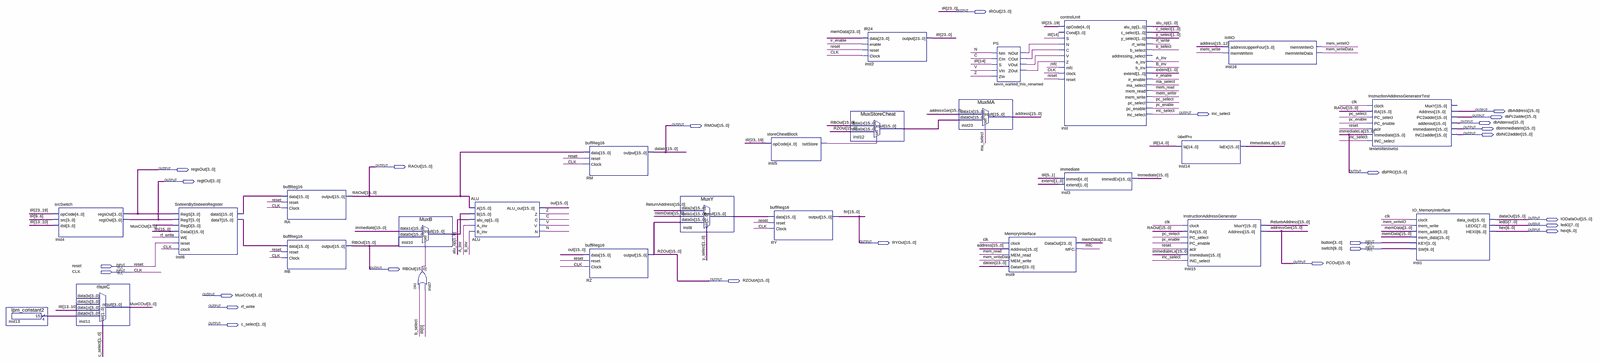
[diagram p0: schematic sheet, whole]
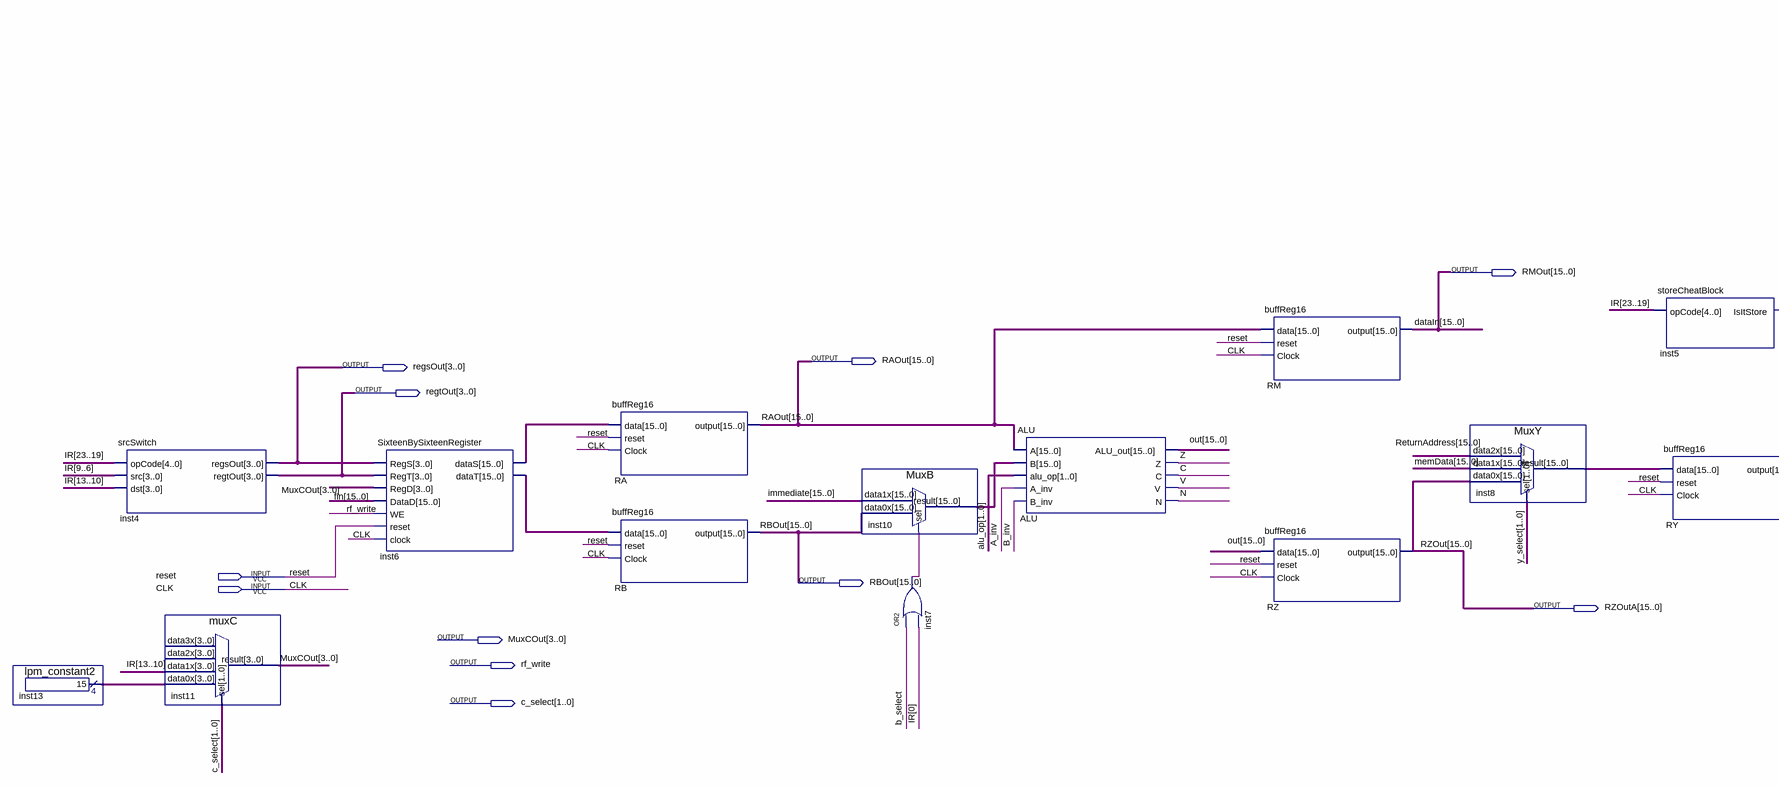
[diagram p1: schematic sheet, left part]
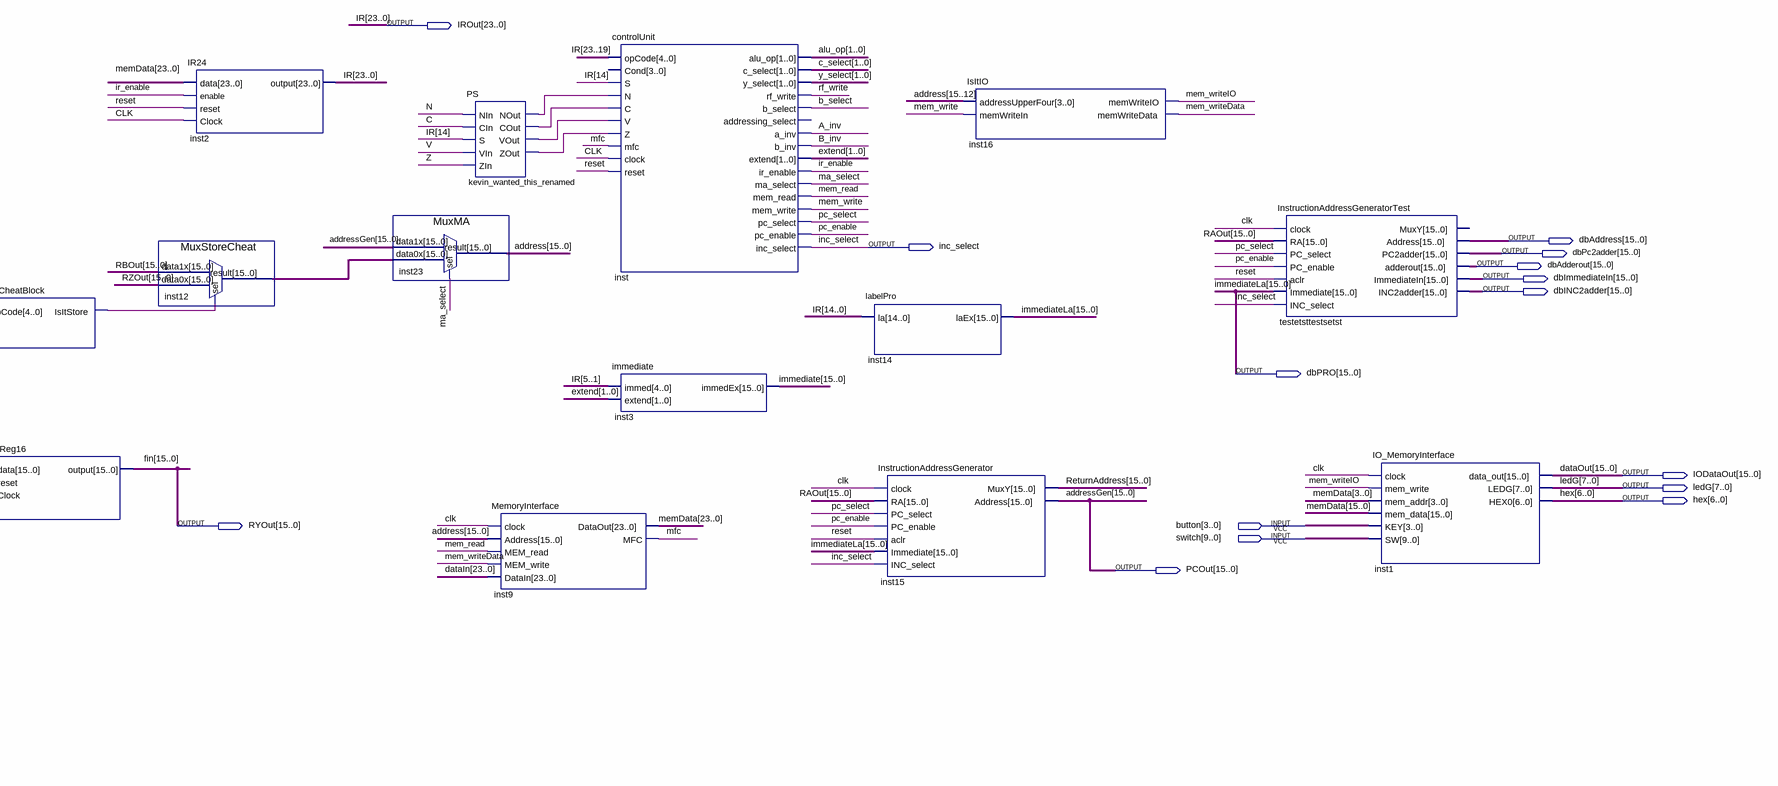
[diagram p2: schematic sheet, right part]
// Quartus schematic Processor.bdf as structural Verilog: 26 symbols, 26 pins
module Processor (
  input  [3:0] button,
  input  [9:0] switch,
  input  reset,
  input  CLK,
  output [23:0] IROut,
  output [15:0] dbAddress,
  output inc_select,
  output [15:0] dbPc2adder,
  output [15:0] dbAdderout,
  output [15:0] RMOut,
  output [15:0] dbImmediateIn,
  output [15:0] dbINC2adder,
  output [15:0] RAOut,
  output [3:0] regsOut,
  output [15:0] dbPRO,
  output [3:0] regtOut,
  output [15:0] IODataOut,
  output [7:0] ledG,
  output [6:0] hex,
  output [15:0] RYOut,
  output [15:0] PCOut,
  output [15:0] RBOut,
  output [15:0] RZOutA,
  output [3:0] MuxCOut,
  output rf_write,
  output [1:0] c_select
);

  wire A_inv, B_inv, b_select, C, inst5_isitstore, inst7_out, ir_enable, kevin_wanted_this_renamed_cout,
       kevin_wanted_this_renamed_nout, kevin_wanted_this_renamed_vout, kevin_wanted_this_renamed_zout,
       ma_select, mem_read, mem_write, mem_writeData, mem_writeIO, mfc, N, pc_enable, pc_select, V, Z;
  wire [1:0] alu_op, extend, y_select;
  wire [3:0] inst13_result;
  wire [15:0] address, immediate, inst6_datas, inst6_datat, inst8_result, inst10_result, inst12_result, out,
       ReturnAddress;
  wire [23:0] memData;
  wire [23:16] dataIn;

  lpm_constant2 inst13 (.result(inst13_result));
  srcSwitch inst4 (.opCode(IROut[23:19]), .src(IROut[9:6]), .dst(IROut[13:10]), .regsOut(regsOut), .regtOut(regtOut));
  muxC inst11 (
    .data1x(IROut[13:10]), .data0x(inst13_result), .sel(c_select), .result(MuxCOut));  // open: data3x, data2x
  SixteenBySixteenRegister inst6 (
    .RegS(regsOut), .RegT(regtOut), .RegD(MuxCOut), .DataD(RYOut), .WE(rf_write), .reset(reset), .clock(CLK),
    .dataS(inst6_datas), .dataT(inst6_datat));
  buffReg16 RA (.data(inst6_datas), .reset(reset), .Clock(CLK), .\output (RAOut));
  buffReg16 RB (.data(inst6_datat), .reset(reset), .Clock(CLK), .\output (RBOut));
  MuxB inst10 (.data1x(immediate), .data0x(RBOut), .sel(inst7_out), .result(inst10_result));
  or inst7 (inst7_out, b_select, IROut[0]);
  ALU ALU (
    .A(RAOut), .B(inst10_result), .alu_op(alu_op), .A_inv(A_inv), .B_inv(B_inv), .ALU_out(out), .Z(Z), .C(C),
    .V(V), .N(N));
  buffReg16 RM (.data(RAOut), .reset(reset), .Clock(CLK), .\output (RMOut));
  buffReg16 RZ (.data(out), .reset(reset), .Clock(CLK), .\output (RZOutA));
  MuxY inst8 (.data2x(ReturnAddress), .data1x(memData[15:0]), .data0x(RZOutA), .sel(y_select), .result(inst8_result));
  storeCheatBlock inst5 (.opCode(IROut[23:19]), .IsItStore(inst5_isitstore));
  buffReg16 RY (.data(inst8_result), .reset(reset), .Clock(CLK), .\output (RYOut));
  IR24 inst2 (.data(memData), .enable(ir_enable), .reset(reset), .Clock(CLK), .\output (IROut));
  MuxStoreCheat inst12 (.data1x(RBOut), .data0x(RZOutA), .sel(inst5_isitstore), .result(inst12_result));
  MuxMA inst23 (.data1x(PCOut), .data0x(inst12_result), .sel(ma_select), .result(address));
  PS kevin_wanted_this_renamed (
    .NIn(N), .CIn(C), .S(IROut[14]), .VIn(V), .ZIn(Z), .NOut(kevin_wanted_this_renamed_nout),
    .COut(kevin_wanted_this_renamed_cout), .VOut(kevin_wanted_this_renamed_vout),
    .ZOut(kevin_wanted_this_renamed_zout));
  MemoryInterface inst9 (
    .clock(CLK), .Address(address), .MEM_read(mem_read), .MEM_write(mem_writeData), .DataIn({dataIn, RMOut}),
    .DataOut(memData), .MFC(mfc));
  controlUnit inst (
    .opCode(IROut[23:19]), .S(IROut[14]), .N(kevin_wanted_this_renamed_nout),
    .C(kevin_wanted_this_renamed_cout), .V(kevin_wanted_this_renamed_vout),
    .Z(kevin_wanted_this_renamed_zout), .mfc(mfc), .clock(CLK), .reset(reset), .alu_op(alu_op),
    .c_select(c_select), .y_select(y_select), .rf_write(rf_write), .b_select(b_select), .a_inv(A_inv),
    .b_inv(B_inv), .extend(extend), .ir_enable(ir_enable), .ma_select(ma_select), .mem_read(mem_read),
    .mem_write(mem_write), .pc_select(pc_select), .pc_enable(pc_enable), .inc_select(inc_select));  // open: Cond, addressing_select
  immediate inst3 (.immed(IROut[5:1]), .extend(extend), .immedEx(immediate));
  labelPro inst14 (.la(IROut[14:0]), .laEx(dbPRO));
  InstructionAddressGenerator inst15 (
    .clock(CLK), .RA(RAOut), .PC_select(pc_select), .PC_enable(pc_enable), .aclr(reset), .Immediate(dbPRO),
    .INC_select(inc_select), .MuxY(ReturnAddress), .Address(PCOut));
  IsItIO inst16 (
    .addressUpperFour(address[15:12]), .memWriteIn(mem_write), .memWriteIO(mem_writeIO),
    .memWriteData(mem_writeData));
  InstructionAddressGeneratorTest testetsttestsetst (
    .clock(CLK), .RA(RAOut), .PC_select(pc_select), .PC_enable(pc_enable), .aclr(reset), .Immediate(dbPRO),
    .INC_select(inc_select), .Address(dbAddress), .PC2adder(dbPc2adder), .adderout(dbAdderout),
    .ImmediateIn(dbImmediateIn), .INC2adder(dbINC2adder));  // open: MuxY
  IO_MemoryInterface inst1 (
    .clock(CLK), .mem_write(mem_writeIO), .mem_addr(memData[3:0]), .mem_data(memData[15:0]), .KEY(button),
    .SW(switch), .data_out(IODataOut), .LEDG(ledG), .HEX0(hex));

  // Other names for the same wires on the sheet: dataOut[15:0] = IODataOut; immediateLa[15:0] = dbPRO;
  //   fin[15:0] = RYOut; IR[23:0] = IROut; addressGen[15:0] = PCOut; dataIn[15:0] = RMOut; RZOut[15:0] = RZOutA
endmodule
